# EAGLE design PulpPad (EAGLE 9.1.3)
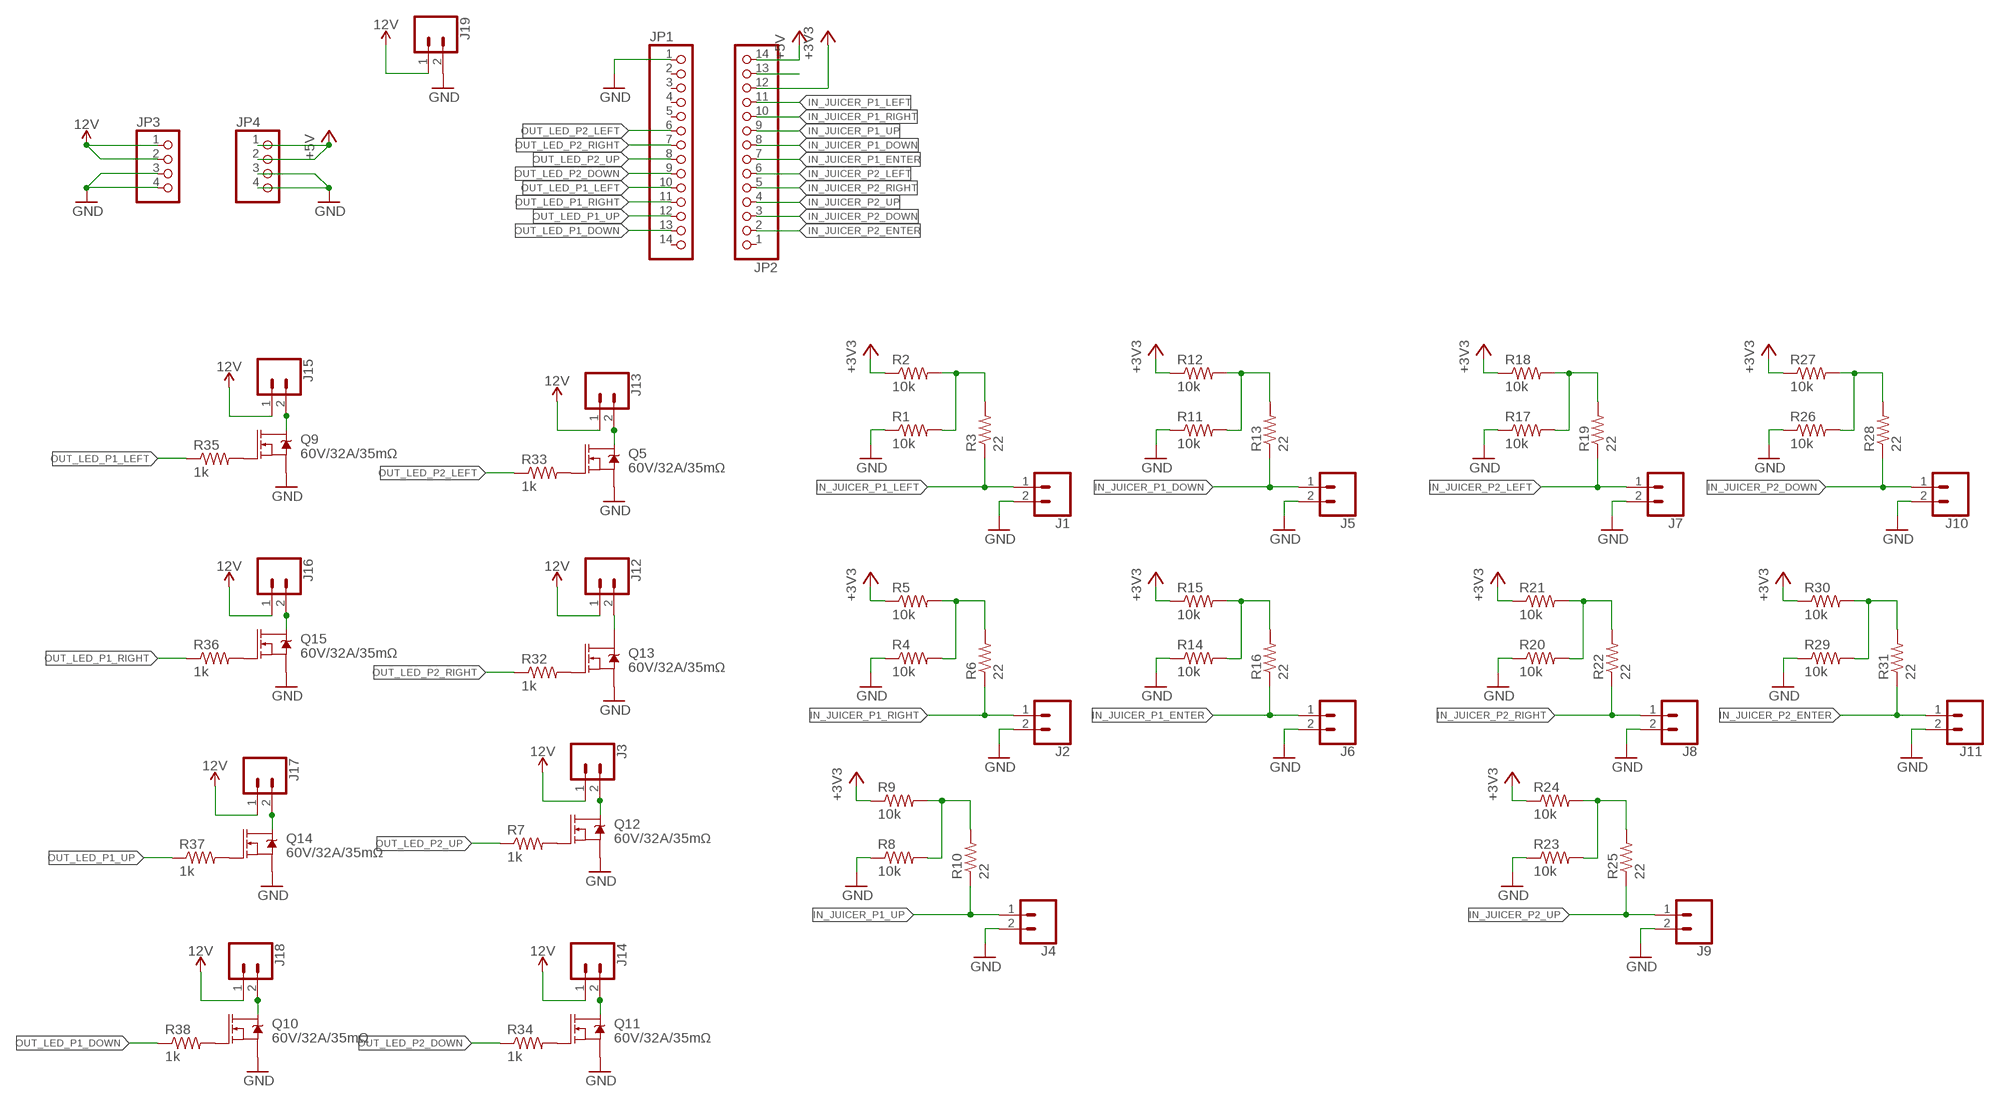
[diagram p0: schematic, sheet 1]

## Parts
J1  CONN_023.5MM  [SCREWTERMINAL-3.5MM-2]
J2  CONN_023.5MM  [SCREWTERMINAL-3.5MM-2]
J3  CONN_023.5MM  [SCREWTERMINAL-3.5MM-2]
J4  CONN_023.5MM  [SCREWTERMINAL-3.5MM-2]
J5  CONN_023.5MM  [SCREWTERMINAL-3.5MM-2]
J6  CONN_023.5MM  [SCREWTERMINAL-3.5MM-2]
J7  CONN_023.5MM  [SCREWTERMINAL-3.5MM-2]
J8  CONN_023.5MM  [SCREWTERMINAL-3.5MM-2]
J9  CONN_023.5MM  [SCREWTERMINAL-3.5MM-2]
J10  CONN_023.5MM  [SCREWTERMINAL-3.5MM-2]
J11  CONN_023.5MM  [SCREWTERMINAL-3.5MM-2]
J12  CONN_023.5MM  [SCREWTERMINAL-3.5MM-2]
J13  CONN_023.5MM  [SCREWTERMINAL-3.5MM-2]
J14  CONN_023.5MM  [SCREWTERMINAL-3.5MM-2]
J15  CONN_023.5MM  [SCREWTERMINAL-3.5MM-2]
J16  CONN_023.5MM  [SCREWTERMINAL-3.5MM-2]
J17  CONN_023.5MM  [SCREWTERMINAL-3.5MM-2]
J18  CONN_023.5MM  [SCREWTERMINAL-3.5MM-2]
J19  CONN_023.5MM  [SCREWTERMINAL-3.5MM-2]
JP1  PINHD-1X14  [1X14]
JP2  PINHD-1X14  [1X14]
JP3  PINHD-1X4  [1X04]
JP4  PINHD-1X4  [1X04]
Q5  60V/32A/35mΩ  MOSFET-NCH-FQP30N06L  [TO220V]
Q9  60V/32A/35mΩ  MOSFET-NCH-FQP30N06L  [TO220V]
Q10  60V/32A/35mΩ  MOSFET-NCH-FQP30N06L  [TO220V]
Q11  60V/32A/35mΩ  MOSFET-NCH-FQP30N06L  [TO220V]
Q12  60V/32A/35mΩ  MOSFET-NCH-FQP30N06L  [TO220V]
Q13  60V/32A/35mΩ  MOSFET-NCH-FQP30N06L  [TO220V]
Q14  60V/32A/35mΩ  MOSFET-NCH-FQP30N06L  [TO220V]
Q15  60V/32A/35mΩ  MOSFET-NCH-FQP30N06L  [TO220V]
R1  10k  R-US_0204/7  [0204/7]
R2  10k  R-US_0204/7  [0204/7]
R3  22  R-US_0204/7  [0204/7]
R4  10k  R-US_0204/7  [0204/7]
R5  10k  R-US_0204/7  [0204/7]
R6  22  R-US_0204/7  [0204/7]
R7  1k  R-US_0204/7  [0204/7]
R8  10k  R-US_0204/7  [0204/7]
R9  10k  R-US_0204/7  [0204/7]
R10  22  R-US_0204/7  [0204/7]
R11  10k  R-US_0204/7  [0204/7]
R12  10k  R-US_0204/7  [0204/7]
R13  22  R-US_0204/7  [0204/7]
R14  10k  R-US_0204/7  [0204/7]
R15  10k  R-US_0204/7  [0204/7]
R16  22  R-US_0204/7  [0204/7]
R17  10k  R-US_0204/7  [0204/7]
R18  10k  R-US_0204/7  [0204/7]
R19  22  R-US_0204/7  [0204/7]
R20  10k  R-US_0204/7  [0204/7]
R21  10k  R-US_0204/7  [0204/7]
R22  22  R-US_0204/7  [0204/7]
R23  10k  R-US_0204/7  [0204/7]
R24  10k  R-US_0204/7  [0204/7]
R25  22  R-US_0204/7  [0204/7]
R26  10k  R-US_0204/7  [0204/7]
R27  10k  R-US_0204/7  [0204/7]
R28  22  R-US_0204/7  [0204/7]
R29  10k  R-US_0204/7  [0204/7]
R30  10k  R-US_0204/7  [0204/7]
R31  22  R-US_0204/7  [0204/7]
R32  1k  R-US_0204/7  [0204/7]
R33  1k  R-US_0204/7  [0204/7]
R34  1k  R-US_0204/7  [0204/7]
R35  1k  R-US_0204/7  [0204/7]
R36  1k  R-US_0204/7  [0204/7]
R37  1k  R-US_0204/7  [0204/7]
R38  1k  R-US_0204/7  [0204/7]

## Nets
12V: J3.1 J12.1 J13.1 J14.1 J15.1 J16.1 J17.1 J18.1 J19.1 JP3.1 JP3.2
+3V3: JP2.12 R2.1 R5.1 R9.1 R12.1 R15.1 R18.1 R21.1 R24.1 R27.1 R30.1
+5V: JP2.14 JP4.1 JP4.2
GND: J1.2 J2.2 J4.2 J5.2 J6.2 J7.2 J8.2 J9.2 J10.2 J11.2 J19.2 JP1.1 JP3.3 JP3.4 JP4.3 JP4.4 Q5.3(S) Q9.3(S) Q10.3(S) Q11.3(S) Q12.3(S) Q13.3(S) Q14.3(S) Q15.3(S) R1.1 R4.1 R8.1 R11.1 R14.1 R17.1 R20.1 R23.1 R26.1 R29.1
IN_JUICER_P1_DOWN: J5.1 JP2.8 R13.1
IN_JUICER_P1_ENTER: J6.1 JP2.7 R16.1
IN_JUICER_P1_LEFT: J1.1 JP2.11 R3.1
IN_JUICER_P1_RIGHT: J2.1 JP2.10 R6.1
IN_JUICER_P1_UP: J4.1 JP2.9 R10.1
IN_JUICER_P2_DOWN: J10.1 JP2.3 R28.1
IN_JUICER_P2_ENTER: J11.1 JP2.2 R31.1
IN_JUICER_P2_LEFT: J7.1 JP2.6 R19.1
IN_JUICER_P2_RIGHT: J8.1 JP2.5 R22.1
IN_JUICER_P2_UP: J9.1 JP2.4 R25.1
N$1: R1.2 R2.2 R3.2
N$2: Q15.1(G) R36.2
N$3: JP2.13
N$4: J3.2 Q12.2(D)
N$5: R8.2 R9.2 R10.2
N$6: R4.2 R5.2 R6.2
N$7: R11.2 R12.2 R13.2
N$8: R14.2 R15.2 R16.2
N$9: R17.2 R18.2 R19.2
N$10: R20.2 R21.2 R22.2
N$11: R23.2 R24.2 R25.2
N$12: R26.2 R27.2 R28.2
N$13: R29.2 R30.2 R31.2
N$14: Q14.1(G) R37.2
N$15: J12.2 Q13.2(D)
N$16: Q10.1(G) R38.2
N$17: J13.2 Q5.2(D)
N$18: Q5.1(G) R33.2
N$19: J14.2 Q11.2(D)
N$20: Q9.1(G) R35.2
N$21: J15.2 Q9.2(D)
N$22: Q13.1(G) R32.2
N$23: J16.2 Q15.2(D)
N$24: Q12.1(G) R7.2
N$25: J17.2 Q14.2(D)
N$26: Q11.1(G) R34.2
N$27: J18.2 Q10.2(D)
OUT_LED_P1_DOWN: JP1.13 R38.1
OUT_LED_P1_LEFT: JP1.10 R35.1
OUT_LED_P1_RIGHT: JP1.11 R36.1
OUT_LED_P1_UP: JP1.12 R37.1
OUT_LED_P2_DOWN: JP1.9 R34.1
OUT_LED_P2_LEFT: JP1.6 R33.1
OUT_LED_P2_RIGHT: JP1.7 R32.1
OUT_LED_P2_UP: JP1.8 R7.1
Unconnected: JP1.2 JP1.3 JP1.4 JP1.5 JP1.14 JP2.1

## Library data of the parts
J1-J19 = SparkFun-Connectors:CONN_02: Multi connection point. Often used as Generic Header-pin footprint for 0.1 inch spaced/style header connections On any of the 0.1 inch spaced packages, you can populate with these: Break Away Headers - Straight <https://www.sparkfun.com/products/116> (PRT-00116) Break Away Male Headers - Right Angle <https://www.sparkfun.com/products/553> (PRT-00553) Female Headers <https://www.sparkfun.com/products/115> (PRT-00115) Break Away Headers - Machine Pin <https://www.sparkfun.com/products/117> (PRT-00117) Break Away Female Headers - Swiss Machine Pin <https://www.sparkfun.com/products/743> (PRT-00743) For SCREWTERMINALS and SPRING TERMINALS visit here: Screw Terimnals on SparkFun.com <https://www.sparkfun.com/search/results?term=Screw+Terminals> (5mm/3.5mm/2.54mm spacing) This device is also useful as a general connection point to wire up your design to another part of your project. Our various solder wires solder well into these plated through hole pads. Hook-Up Wire - Assortment (Stranded, 22 AWG) <https://www.sparkfun.com/products/11375> (PRT-11375) Hook-Up Wire - Assortment (Solid Core, 22 AWG) <https://www.sparkfun.com/products/11367> (PRT-11367) View the entire wire category on our website here <https://www.sparkfun.com/categories/141> Special notes: Molex polarized connector foot print use with: PRT-08233 with associated crimp pins and housings. 2.54_SCREWTERM for use with PRT-10571. 3.5mm Screw Terminal footprints for PRT-08084 5mm Screw Terminal footprints for use with PRT-08432; PROD_ID: CONN-08399
JP1 JP2 = pinhead:PINHD-1X14: PIN HEADER
JP3 JP4 = pinhead:PINHD-1X4: PIN HEADER
Q5 Q9-Q15 = SparkFun-DiscreteSemi:MOSFET-NCH: N-channel MOSFETs Voltage controlled devices that allow control of high current outputs. SparkFun Products: SparkFun OpenScale <https://www.sparkfun.com/products/13261> SparkFun Digital Sandbox <https://www.sparkfun.com/products/12651> SparkFun Monster Moto Shield <https://www.sparkfun.com/products/10182> SparkFun MOSFET Power Controller <https://www.sparkfun.com/products/11214>; PROD_ID: TRANS-10060
R1-R38 = rcl:R-US_: RESISTOR, American symbol; SPICEPREFIX: R

## Net classes
0 default: clearance 0.205 mm

## Board
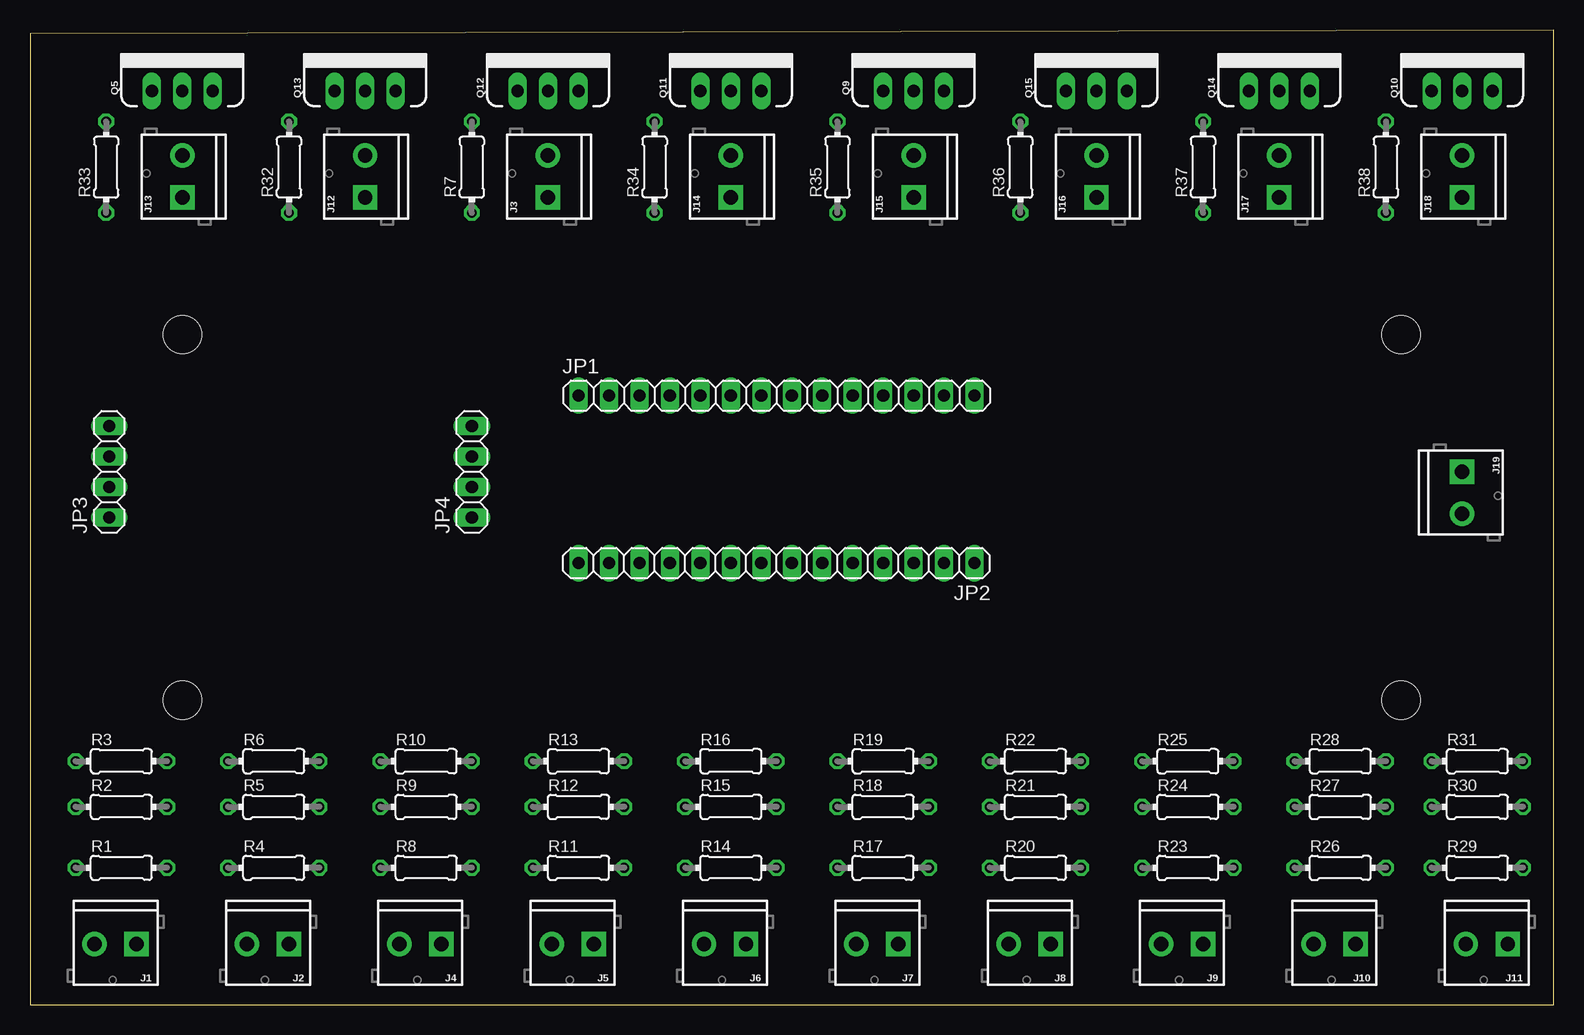
[diagram p1: board, top side]
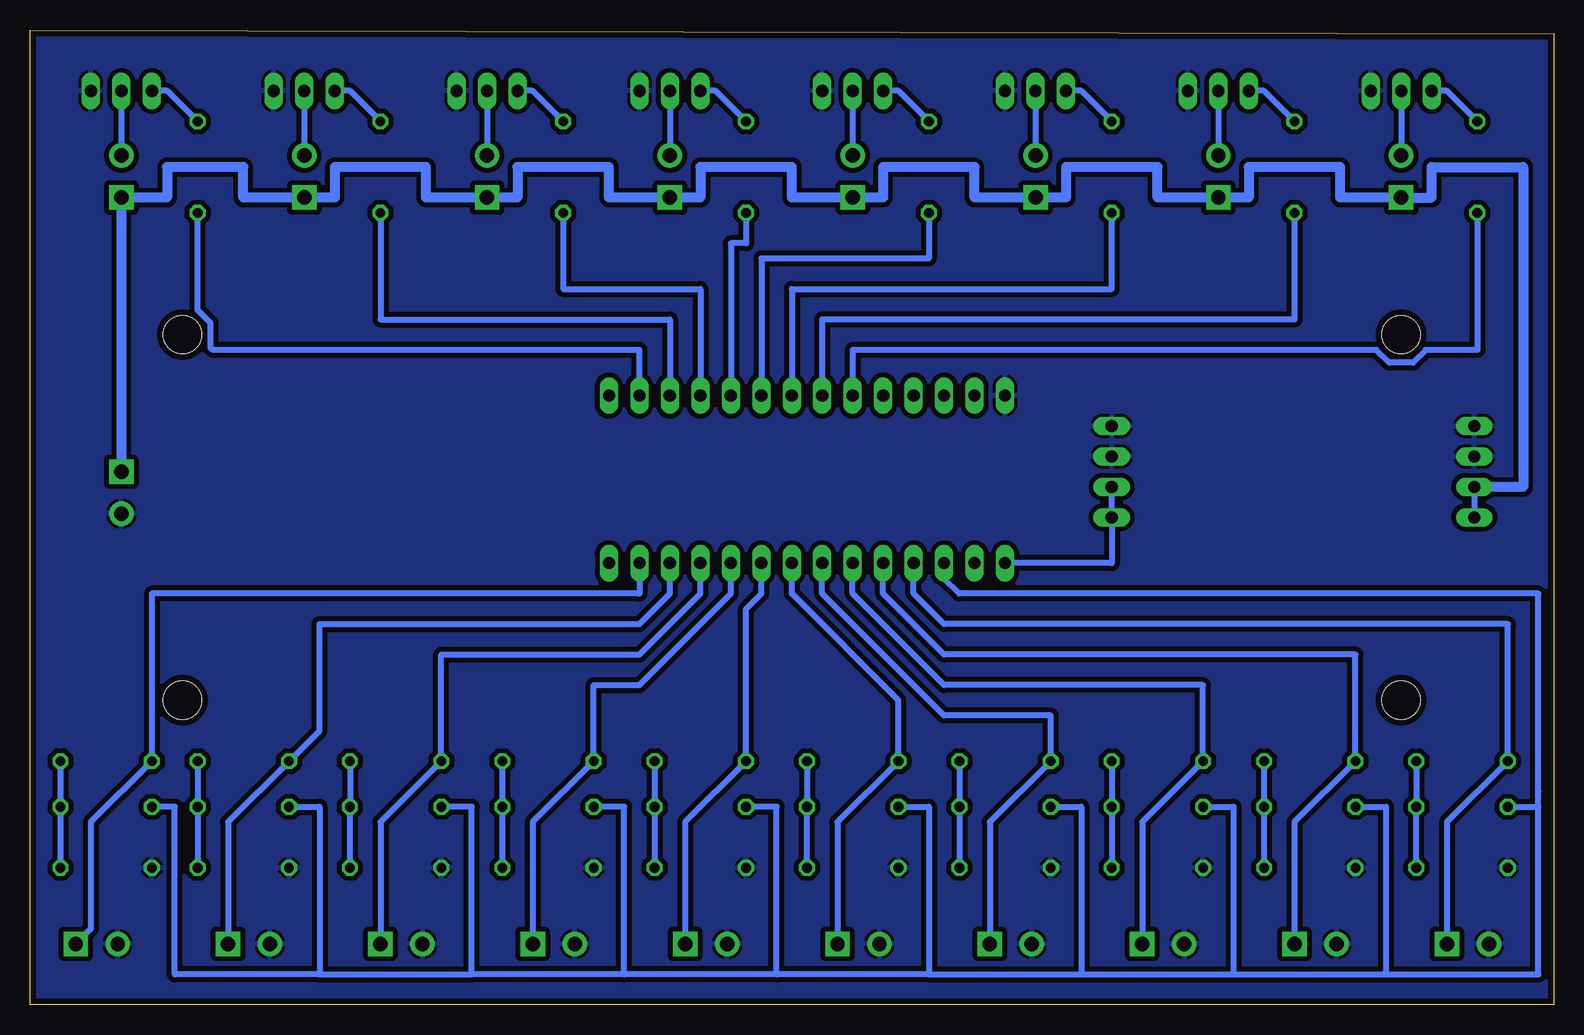
[diagram p2: board, bottom side, seen from below]

Size 127 x 81.28 mm. Coordinates in mm from the lower left corner, seen from the top.
Outline: 0,0 127,0 127,81.28 0,80.95 0,0
Copper layers (1*16): Top 0.035mm / dielectric 1.5mm / Bottom 0.035mm
Design rules "default *": minimum track width 6mil, minimum drill 0.35mm, track to track 6mil, track to pad 6mil, pad to pad 6mil, via to via 6mil, smd to smd 6mil, copper to edge 20mil, drill to drill 6mil, minimum pad ring 10mil, minimum via ring 8mil, stop-mask expansion 4mil, vias tented up to drill 0mil, thermal gap 10mil
Holes 3.17 mm at 12.7,25.4 114.3,25.4 12.7,55.88 114.3,55.88

### Footprints (pad centres in the part's own frame; a part is rotated, then mirrored left to right if it is on the bottom)
SCREWTERMINAL-3.5MM-2 = drill 1.2 pad 2.032 square: 1 0,0 | drill 1.2 pad 2.032: 2 3.5,0
1X14 = drill 1.016 long: 1 -16.51,0; 2 -13.97,0; 3 -11.43,0; 4 -8.89,0; 5 -6.35,0; 6 -3.81,0; 7 -1.27,0; 8 1.27,0; 9 3.81,0; 10 6.35,0; 11 8.89,0; 12 11.43,0; 13 13.97,0; 14 16.51,0
1X04 = drill 1.016 long: 1 -3.81,0; 2 -1.27,0; 3 1.27,0; 4 3.81,0
TO220V = drill 1.016 long: 1 -2.54,0; 2 0,0; 3 2.54,0
0204/7 = drill 0.813 octagon: 1 -3.81,0; 2 3.81,0

### Placement (x,y rotation side)
J1  8.89,5.08 180 top
J2  21.59,5.08 180 top
J3  43.18,67.31 90 top
J4  34.29,5.08 180 top
J5  46.99,5.08 180 top
J6  59.69,5.08 180 top
J7  72.39,5.08 180 top
J8  85.09,5.08 180 top
J9  97.79,5.08 180 top
J10  110.49,5.08 180 top
J11  123.19,5.08 180 top
J12  27.94,67.31 90 top
J13  12.7,67.31 90 top
J14  58.42,67.31 90 top
J15  73.66,67.31 90 top
J16  88.9,67.31 90 top
J17  104.14,67.31 90 top
J18  119.38,67.31 90 top
J19  119.38,44.45 270 top
JP1  62.23,50.8 0 top
JP2  62.23,36.83 180 top
JP3  6.6,44.45 90 top
JP4  36.83,44.45 90 top
Q5  12.7,76.2 0 top
Q9  73.66,76.2 0 top
Q10  119.38,76.2 0 top
Q11  58.42,76.2 0 top
Q12  43.18,76.2 0 top
Q13  27.94,76.2 0 top
Q14  104.14,76.2 0 top
Q15  88.9,76.2 0 top
R1  7.62,11.43 0 top
R2  7.62,16.51 0 top
R3  7.62,20.32 0 top
R4  20.32,11.43 0 top
R5  20.32,16.51 0 top
R6  20.32,20.32 0 top
R7  36.83,69.85 90 top
R8  33.02,11.43 0 top
R9  33.02,16.51 0 top
R10  33.02,20.32 0 top
R11  45.72,11.43 0 top
R12  45.72,16.51 0 top
R13  45.72,20.32 0 top
R14  58.42,11.43 0 top
R15  58.42,16.51 0 top
R16  58.42,20.32 0 top
R17  71.12,11.43 0 top
R18  71.12,16.51 0 top
R19  71.12,20.32 0 top
R20  83.82,11.43 0 top
R21  83.82,16.51 0 top
R22  83.82,20.32 0 top
R23  96.52,11.43 0 top
R24  96.52,16.51 0 top
R25  96.52,20.32 0 top
R26  109.22,11.43 0 top
R27  109.22,16.51 0 top
R28  109.22,20.32 0 top
R29  120.65,11.43 0 top
R30  120.65,16.51 0 top
R31  120.65,20.32 0 top
R32  21.59,69.85 90 top
R33  6.35,69.85 90 top
R34  52.07,69.85 90 top
R35  67.31,69.85 90 top
R36  82.55,69.85 90 top
R37  97.79,69.85 90 top
R38  113.03,69.85 90 top

### Tracks (layer width: path | path; a pad name or v marks a point on that pad's centre or on a via)
12V
  Bottom 0.508: JP3.2 JP3.1
  Bottom 0.813: JP3.2 2.54,43.18 2.54,69.85 10.16,69.85 10.16,67.31 J13.1 17.78,67.31 17.78,69.85 25.4,69.85 25.4,67.31 J12.1 33.02,67.31 33.02,69.85 40.64,69.85 40.64,67.31 J3.1 48.26,67.31 48.26,69.85 55.88,69.85 55.88,67.31 J14.1 63.5,67.31 63.5,69.85 71.12,69.85 71.12,67.31 J15.1 78.74,67.31 78.74,69.85 86.36,69.85 86.36,67.31 J16.1 93.98,67.31 93.98,69.85 101.6,69.85 101.6,67.31 J17.1 109.22,67.31 109.22,69.85 115.57,69.85 115.57,67.31 J18.1 J19.1
+3V3
  Bottom 0.508: R5.1 13.97,16.51 13.97,2.54 | R9.1 26.67,16.51 26.67,2.54 | R12.1 39.37,16.51 39.37,2.54 | R15.1 52.07,16.51 52.07,2.54 | 64.77,2.54 64.77,16.51 R18.1 | 77.47,2.54 77.47,16.51 R21.1 | 90.17,2.54 90.17,16.51 R24.1 | R27.1 102.87,16.51 102.87,2.54 | 102.87,2.54 114.94,2.54 114.94,16.51 R30.1 | 77.47,2.54 90.17,2.54 | 64.77,2.54 77.47,2.54 | 52.07,2.54 39.37,2.54 | 39.37,2.54 26.67,2.54 | 52.07,2.54 64.77,2.54 | 26.67,2.54 13.97,2.54 | 102.87,2.54 90.17,2.54 | 13.97,2.54 1.27,2.54 1.27,16.51 | JP2.12 50.8,35.56 49.53,34.29 1.27,34.29 1.27,17.78 1.27,16.51 | R2.1 1.27,16.51
+5V
  Bottom 0.508: JP4.2 JP4.1 36.83,36.83 JP2.14
GND
  pour Bottom (isolate 0.406): 0,81.28 129.54,81.28 129.54,0 0,0
IN_JUICER_P1_DOWN
  Bottom 0.508: J5.1 46.99,15.24 R13.1 41.91,24.13 50.8,24.13 60.96,34.29 JP2.8
IN_JUICER_P1_ENTER
  Bottom 0.508: J6.1 59.69,15.24 R16.1 54.61,25.4 63.5,34.29 JP2.7
IN_JUICER_P1_LEFT
  Bottom 0.508: J1.1 8.89,15.24 R3.1 3.81,31.75 50.8,31.75 53.34,34.29 JP2.11
IN_JUICER_P1_RIGHT
  Bottom 0.508: J2.1 21.59,15.24 R6.1 16.51,29.21 50.8,29.21 55.88,34.29 JP2.10
IN_JUICER_P1_UP
  Bottom 0.508: J4.1 34.29,15.24 R10.1 29.21,26.67 50.8,26.67 58.42,34.29 JP2.9
IN_JUICER_P2_DOWN
  Bottom 0.508: J10.1 110.49,15.24 R28.1 102.87,22.86 102.87,31.75 76.2,31.75 73.66,34.29 JP2.3
IN_JUICER_P2_ENTER
  Bottom 0.508: JP2.2 76.2,34.29 116.84,34.29 R31.1 121.92,15.24 121.92,6.35 J11.1
IN_JUICER_P2_LEFT
  Bottom 0.508: J7.1 72.39,15.24 R19.1 67.31,33.02 66.04,34.29 JP2.6
IN_JUICER_P2_RIGHT
  Bottom 0.508: J8.1 85.09,15.24 R22.1 80.01,26.67 76.2,26.67 68.58,34.29 JP2.5
IN_JUICER_P2_UP
  Bottom 0.508: J9.1 97.79,15.24 R25.1 92.71,29.21 76.2,29.21 71.12,34.29 JP2.4
N$1
  Bottom 0.508: R3.2 R2.2 R1.2
N$2
  Bottom 0.508: R36.2 85.09,76.2 Q15.1
N$4
  Bottom 0.508: Q12.2 J3.2
N$5
  Bottom 0.508: R10.2 R9.2 R8.2
N$6
  Bottom 0.508: R6.2 R5.2 R4.2
N$7
  Bottom 0.508: R13.2 R12.2 R11.2
N$8
  Bottom 0.508: R16.2 R15.2 R14.2
N$9
  Bottom 0.508: R19.2 R18.2 R17.2
N$10
  Bottom 0.508: R22.2 R21.2 R20.2
N$11
  Bottom 0.508: R25.2 R24.2 R23.2
N$12
  Bottom 0.508: R28.2 R27.2 R26.2
N$13
  Bottom 0.508: R31.2 R30.2 R29.2
N$14
  Bottom 0.508: R37.2 100.33,76.2 Q14.1
N$15
  Bottom 0.508: Q13.2 J12.2
N$16
  Bottom 0.508: R38.2 115.57,76.2 Q10.1
N$17
  Bottom 0.508: Q5.2 J13.2
N$18
  Bottom 0.508: R33.2 8.89,76.2 Q5.1
N$19
  Bottom 0.508: Q11.2 J14.2
N$20
  Bottom 0.508: R35.2 69.85,76.2 Q9.1
N$21
  Bottom 0.508: Q9.2 J15.2
N$22
  Bottom 0.508: R32.2 24.13,76.2 Q13.1
N$23
  Bottom 0.508: Q15.2 J16.2
N$24
  Bottom 0.508: R7.2 39.37,76.2 Q12.1
N$25
  Bottom 0.508: Q14.2 J17.2
N$26
  Bottom 0.508: R34.2 54.61,76.2 Q11.1
N$27
  Bottom 0.508: Q10.2 J18.2
OUT_LED_P1_DOWN
  Bottom 0.508: JP1.13 76.2,54.61 111.76,54.61 111.95,54.8 111.95,56.85 113.03,57.93 R38.1
OUT_LED_P1_LEFT
  Bottom 0.508: R35.1 67.31,63.5 68.58,63.5 JP1.10
OUT_LED_P1_RIGHT
  Bottom 0.508: R36.1 82.55,59.69 71.12,59.69 JP1.11
OUT_LED_P1_UP
  Bottom 0.508: R37.1 97.79,57.15 73.66,57.15 JP1.12
OUT_LED_P2_DOWN
  Bottom 0.508: R34.1 52.07,62.23 66.04,62.23 JP1.9
OUT_LED_P2_LEFT
  Bottom 0.508: JP1.6 58.42,54.61 14.75,54.61 13.67,53.53 11.73,53.53 10.65,54.61 6.35,54.61 R33.1
OUT_LED_P2_RIGHT
  Bottom 0.508: R32.1 21.59,57.15 60.96,57.15 JP1.7
OUT_LED_P2_UP
  Bottom 0.508: JP1.8 63.5,59.69 36.83,59.69 R7.1